# Altium schematic sheet IdealDiode 03-1.0 complete.SchDoc: complete design
size A4; DocumentNumber: 1; SheetNumber: 1; SheetTotal: 1; VersionControl_RevNumber: 1
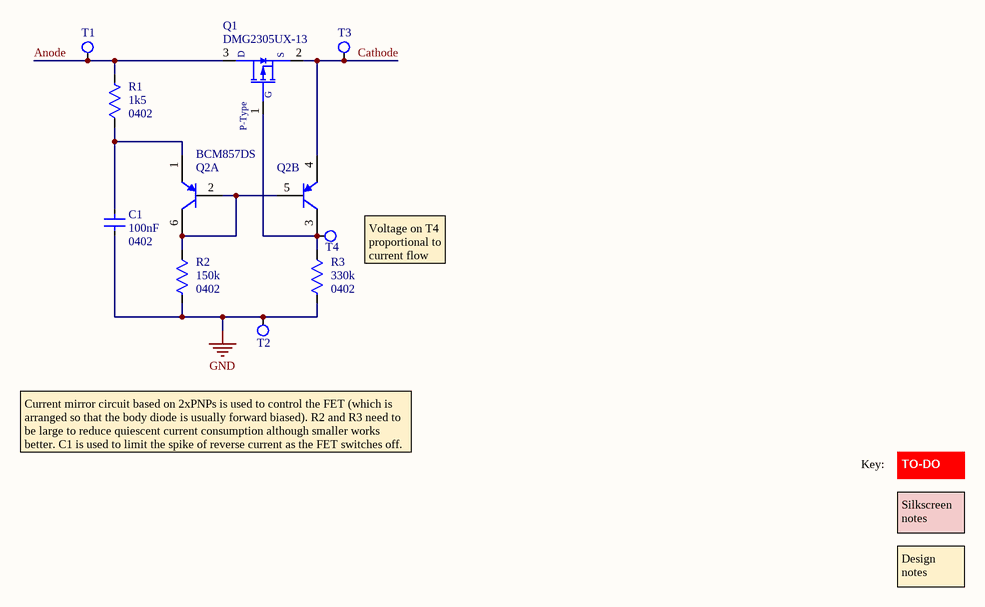
[diagram p0: IdealDiode 03-1.0 complete.SchDoc]

## Parts
C1  Case/Package: 0402  Capacitance: 100nF  [CAP0402]  (hidden comment: 0402YG104ZAT2A)
Q1  Manufacturer Part Number: DMG2305UX-13  [DIODES-SOT23-3]  (hidden comment: MOSFET)
Q2  BCM857DS  [NXP-SOT457]  (parts A,B of 2)
R1  Case: 0402  [RES0402]  (hidden comment: 1k5)
R2  Case: 0402  [RES0402]  (hidden comment: 150k)
R3  Case: 0402  [RES0402]  (hidden comment: 330k)
T1  TestPointHole  [PTH1.5mm-1.0mm]  (value not drawn)  (no BOM)
T2  TestPointHole  [PTH1.5mm-1.0mm]  (value not drawn)  (no BOM)
T3  TestPointHole  [PTH1.5mm-1.0mm]  (value not drawn)  (no BOM)
T4  TestPoint  [Pad1mm]  (value not drawn)  (no BOM)

## Nets
GND: C1.1 R2.2 R3.2 T2.1
Anode: Q1.3(D) R1.2 T1.1
Cathode: Q1.2(S) Q2.4(E2) T3.1
NetC1_2: C1.2 Q2.1(E1) R1.1
NetQ1_1: Q1.1(G) Q2.3(C2) R3.1 T4.1
NetQ2_2: Q2.2(B1) Q2.5(B2) Q2.6(C1) R2.1

## Notes on the sheet
- Voltage on T4 proportional to current flow
- Current mirror circuit based on 2xPNPs is used to control the FET (which is arranged so that the body diode is usually forward biased). R2 and R3 need to be large to reduce quiescent current consumption although smaller works better. C1 is used to limit the spike of reverse current as the FET switches off.
- Key:
- Silkscreen notes
- TO-DO
- Design notes
- PROJECT FILENAME
- PROJECT CODENAME
- Microsoft
- PROJECT DESCRIPTION
- SHEET DESCRIPTION
- SHEET FILENAME
- LICENCE
- LAST MODIFIED
- PAGE
- OF
- DRAWN BY
- REVISION
- PCB ID
- (in symbol DMG2305UX-whitesch) P-Type

## Library data of the parts
C1 = 0402YG104ZAT2A: 100nF 0402 16V; Manufacturer: Kyocera AVX; Tolerance: 80%; Dielectric: Y5V; Insulation Resistance: 100GR; Dissipation Factor: 9%; Supplier 1: Digi-Key; Manufacturer Part Number: 0402YG104ZAT2A; Stock 1: 0; Pricing 1: 1=0.1, 10=0.041, 100=0.0183, 500=0.01306, 1000=0.01026, 2500=0.00933, 5000=0.00858 (USD); Mount: Surface Mount,PCB; Case Code (Metric): 1005; Case Code (Imperial): 0402; Contact Plating: Tin,Matte; Min Operating Temperature: -30°C; Max Operating Temperature: 85°C; Packaging: Tape and Reel; Voltage Rating (DC): 16V; Termination: SMD/SMT; Voltage: 16V; Package Quantity: 1; Voltage Rating: 16V; Length: 1mm; Height: 0.5mm; Depth: 0.5mm; Width: 0.02inch; Thickness: 0.022inch; Radiation Hardening: No; REACH SVHC: No SVHC; Lead Free: Lead Free; ComponentLink2URL: http://datasheets.avx.com/Y5V.pdf; ComponentLink2Description: AVX datasheet online; Supplier 2: Farnell; Supplier 3: Mouser; Supplier 4: RSComponents; Supplier Part Number 1: 478-1138-1-ND; Supplier Part Number 2: 1327667; Supplier Part Number 3: 581-040216G104Z; Supplier Part Number 4: 698-3190
Q1 = DMG2305UX-whitesch: MOSFET P-CH 20V 4.2A SOT23; Manufacturer: Diodes; Rise Time: 13.7ns; Rds On Max: 52mR; Input Capacitance: 808pF; Max Power Dissipation: 1.4W; Turn-On Delay Time: 10.8ns; Turn-Off Delay Time: 79.3ns; Fall Time: 34.7ns; Threshold Voltage: -900mV; Element Configuration: Single; Gate to Source Voltage (Vgs): 8V; Number of Channels: 1; Drain to Source Breakdown Voltage: -20V; On-State Resistance: 65MR; Supplier 1: Digi-Key; Stock 1: 131638; Pricing 1: 1=0.44, 10=0.398, 100=0.2228, 500=0.1194, 1000=0.0812 (USD); Mount: Surface Mount; Case/Package: TO-236-3; Number of Pins: 3; Weight: 0.000282oz; Min Operating Temperature: -55°C; Max Operating Temperature: 150°C; Package Quantity: 1; Packaging: Tape and Reel; Continuous Drain Current (ID): 4.2A; Drain to Source Voltage (Vdss): 20V; Drain to Source Resistance: 52mR; Length: 3mm; Height: 1.1mm; Width: 1.4mm; Radiation Hardening: No; REACH SVHC: No SVHC; Lead Free: Lead Free; ComponentLink2URL: https://datasheet.ciiva.com/18566/dmg2305ux-18566951.pdf; ComponentLink2Description: online datasheet; Supplier Part Number 1: DMG2305UX-13DICT-ND; ComponentLink3Description: datasheet; ComponentLink3URL: Y:\System\Altium\Libraries 2014\Diodes Inc\Datasheets\dmg2305ux-30023840.pdf; Supplier 2: Farnell; Supplier 3: Mouser; Supplier 4: RSComponents; Supplier Part Number 2: 2543533; Supplier Part Number 3: 621-DMG2305UX-7; Supplier Part Number 4: 8270452
Q2 = BCM857DS,115-whitesch: BJT ARRAY, DUAL PNP, -45V, -100MA, 6-SOT-457; Manufacturer: NXP Semiconductors; Max Power Dissipation: 380mW; Collector Emitter Voltage (VCEO): 45V; Collector Base Voltage (VCBO): 50V; Max Collector Current: 100mA; Emitter Base Voltage (VEBO): 5V; Gain Bandwidth Product: 175MHz; Number of Elements: 2; Tolerance: 5%; Test Current: 5mA; Zener Voltage: 3.3V; Supplier 1: Digi-Key; Manufacturer Part Number: BCM857DS,115; Stock 1: 369; Pricing 1: 1=0.46, 10=0.343, 100=0.2137, 500=0.1462, 1000=0.1125 (USD); Mount: Surface Mount; Case/Package: SOT-457; Number of Pins: 6; Weight: 0.01lb; Contact Plating: Tin; Min Operating Temperature: -65°C; Max Operating Temperature: 150°C; Packaging: Tape and Reel; Package Quantity: 1; Polarity: PNP; Element Configuration: Dual; Frequency: 175MHz; Collector Emitter Breakdown Voltage: 45V; Transition Frequency: 175MHz; Max Breakdown Voltage: 45V; Power Dissipation: 380mW; Length: 0.25inch; Height: 0.25inch; Width: 0.25inch; Radiation Hardening: No; REACH SVHC: No SVHC; Lead Free: Lead Free; Supplier Part Number 1: 1727-4884-1-ND; ComponentLink1Description: online datasheet; ComponentLink1URL: https://assets.nexperia.com/documents/data-sheet/BCM857BV_BS_DS.pdf
R1 = RES0402_GENERIC: Generic 0402 Chip Resistor 1k5; Value: 1k5
R2 = RES0402_GENERIC: Generic 0402 Chip Resistor 150k; Value: 150k
R3 = RES0402_GENERIC: Generic 0402 Chip Resistor 330k; Value: 330k
T1-T3 = TestPointHole: Test Point With Hole
T4 = TestPoint: Test Point